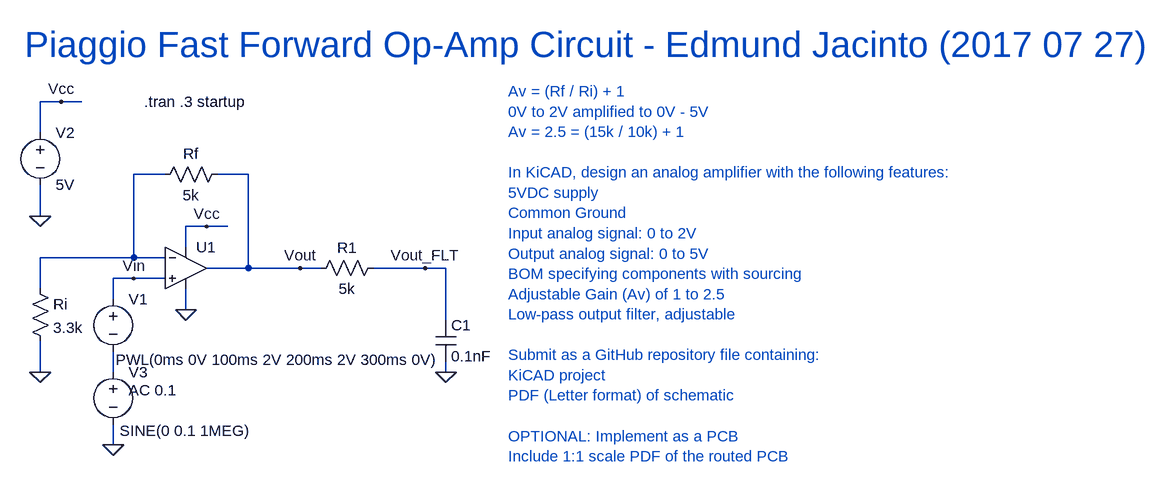
[diagram p0: schematic Piaggio Amp Circuit Sim.asc]
Piaggio Amp Circuit Sim.asc, the LTspice schematic file:
Version 4
SHEET 1 2812 680
WIRE -112 -128 -144 -128
WIRE -80 -128 -112 -128
WIRE -144 -80 -144 -128
WIRE 48 -16 0 -16
WIRE 176 -16 128 -16
WIRE -144 48 -144 0
WIRE 112 64 80 64
WIRE 144 64 112 64
WIRE 80 96 80 64
WIRE 0 112 0 -16
WIRE 0 112 -144 112
WIRE 48 112 0 112
WIRE 176 128 176 -16
WIRE 176 128 112 128
WIRE 256 128 176 128
WIRE 288 128 256 128
WIRE 448 128 368 128
WIRE 480 128 448 128
WIRE 0 144 -32 144
WIRE 48 144 0 144
WIRE -144 160 -144 112
WIRE -32 176 -32 144
WIRE 80 192 80 160
WIRE 480 208 480 128
WIRE -144 288 -144 240
WIRE -32 288 -32 256
WIRE 480 288 480 272
WIRE -32 400 -32 368
FLAG -144 48 0
FLAG -112 -128 Vcc
FLAG 112 64 Vcc
FLAG -32 400 0
FLAG 0 144 Vin
FLAG 256 128 Vout
FLAG -144 288 0
FLAG 80 192 0
FLAG 480 288 0
FLAG 448 128 Vout_FLT
SYMBOL voltage -144 -96 R0
SYMATTR InstName V2
SYMATTR Value 5V
SYMBOL Opamps\\UniversalOpamp2 80 128 R0
SYMATTR InstName U1
SYMATTR SpiceLine ilimit=25 rail=0 Vos=0 phimargin=45
SYMBOL res -160 144 R0
SYMATTR InstName Ri
SYMATTR Value 3.3k
SYMBOL res 32 0 R270
WINDOW 0 32 56 VTop 2
WINDOW 3 0 56 VBottom 2
SYMATTR InstName Rf
SYMATTR Value 5k
SYMBOL voltage -32 160 R0
WINDOW 123 24 44 Left 2
WINDOW 39 0 0 Left 2
WINDOW 3 4 109 Left 2
SYMATTR Value PWL(0ms 0V 100ms 2V 200ms 2V 300ms 0V)
SYMATTR InstName V1
SYMBOL res 384 112 R90
WINDOW 0 0 56 VBottom 2
WINDOW 3 32 56 VTop 2
SYMATTR InstName R1
SYMATTR Value 5k
SYMBOL cap 464 208 R0
SYMATTR InstName C1
SYMATTR Value 0.1nF
SYMBOL voltage -32 272 R0
WINDOW 123 24 44 Left 2
WINDOW 39 0 0 Left 2
WINDOW 3 10 106 Left 2
SYMATTR Value2 AC 0.1
SYMATTR Value SINE(0 0.1 1MEG)
SYMATTR InstName V3
TEXT 16 -128 Left 2 !.tran .3 startup
TEXT -168 -216 Left 5 ;Piaggio Fast Forward Op-Amp Circuit - Edmund Jacinto (2017 07 27)
TEXT 576 -144 Left 2 ;Av = (Rf / Ri) + 1\n0V to 2V amplified to 0V - 5V\nAv = 2.5 = (15k / 10k) + 1\n \nIn KiCAD, design an analog amplifier with the following features:\n5VDC supply\nCommon Ground\nInput analog signal: 0 to 2V\nOutput analog signal: 0 to 5V\nBOM specifying components with sourcing\nAdjustable Gain (Av) of 1 to 2.5\nLow-pass output filter, adjustable\n \nSubmit as a GitHub repository file containing:\nKiCAD project\nPDF (Letter format) of schematic\n \nOPTIONAL: Implement as a PCB \nInclude 1:1 scale PDF of the routed PCB

The netlist it stands for:
* Piaggio Amp Circuit Sim.asc
V2 Vcc 0 5V
XU1 Vin N001 Vcc 0 Vout level.2 Avol=1Meg GBW=10Meg Slew=10Meg ilimit=25 rail=0 Vos=0 phimargin=45 en=0 enk=0 in=0 ink=0 Rin=500Meg  ; pins IN+ IN- V+ V- OUT
Ri N001 0 3.3k
Rf N001 Vout 5k
V1 Vin N002 PWL(0ms 0V 100ms 2V 200ms 2V 300ms 0V)
R1 Vout_FLT Vout 5k
C1 Vout_FLT 0 0.1nF
V3 N002 0 SINE(0 0.1 1MEG) AC 0.1
.tran .3 startup
* Piaggio Fast Forward Op-Amp Circuit - Edmund Jacinto (2017 07 27)
* Av = (Rf / Ri) + 1
* 0V to 2V amplified to 0V - 5V
* Av = 2.5 = (15k / 10k) + 1
* In KiCAD, design an analog amplifier with the following features:
* 5VDC supply
* Common Ground
* Input analog signal: 0 to 2V
* Output analog signal: 0 to 5V
* BOM specifying components with sourcing
* Adjustable Gain (Av) of 1 to 2.5
* Low-pass output filter, adjustable
* Submit as a GitHub repository file containing:
* KiCAD project
* PDF (Letter format) of schematic
* OPTIONAL: Implement as a PCB
* Include 1:1 scale PDF of the routed PCB
.lib UniversalOpamps2.sub
.backanno
.end